# Altium schematic sheet LED_Sch.SchDoc
size A3; SheetNumber: 1; SheetTotal: 1
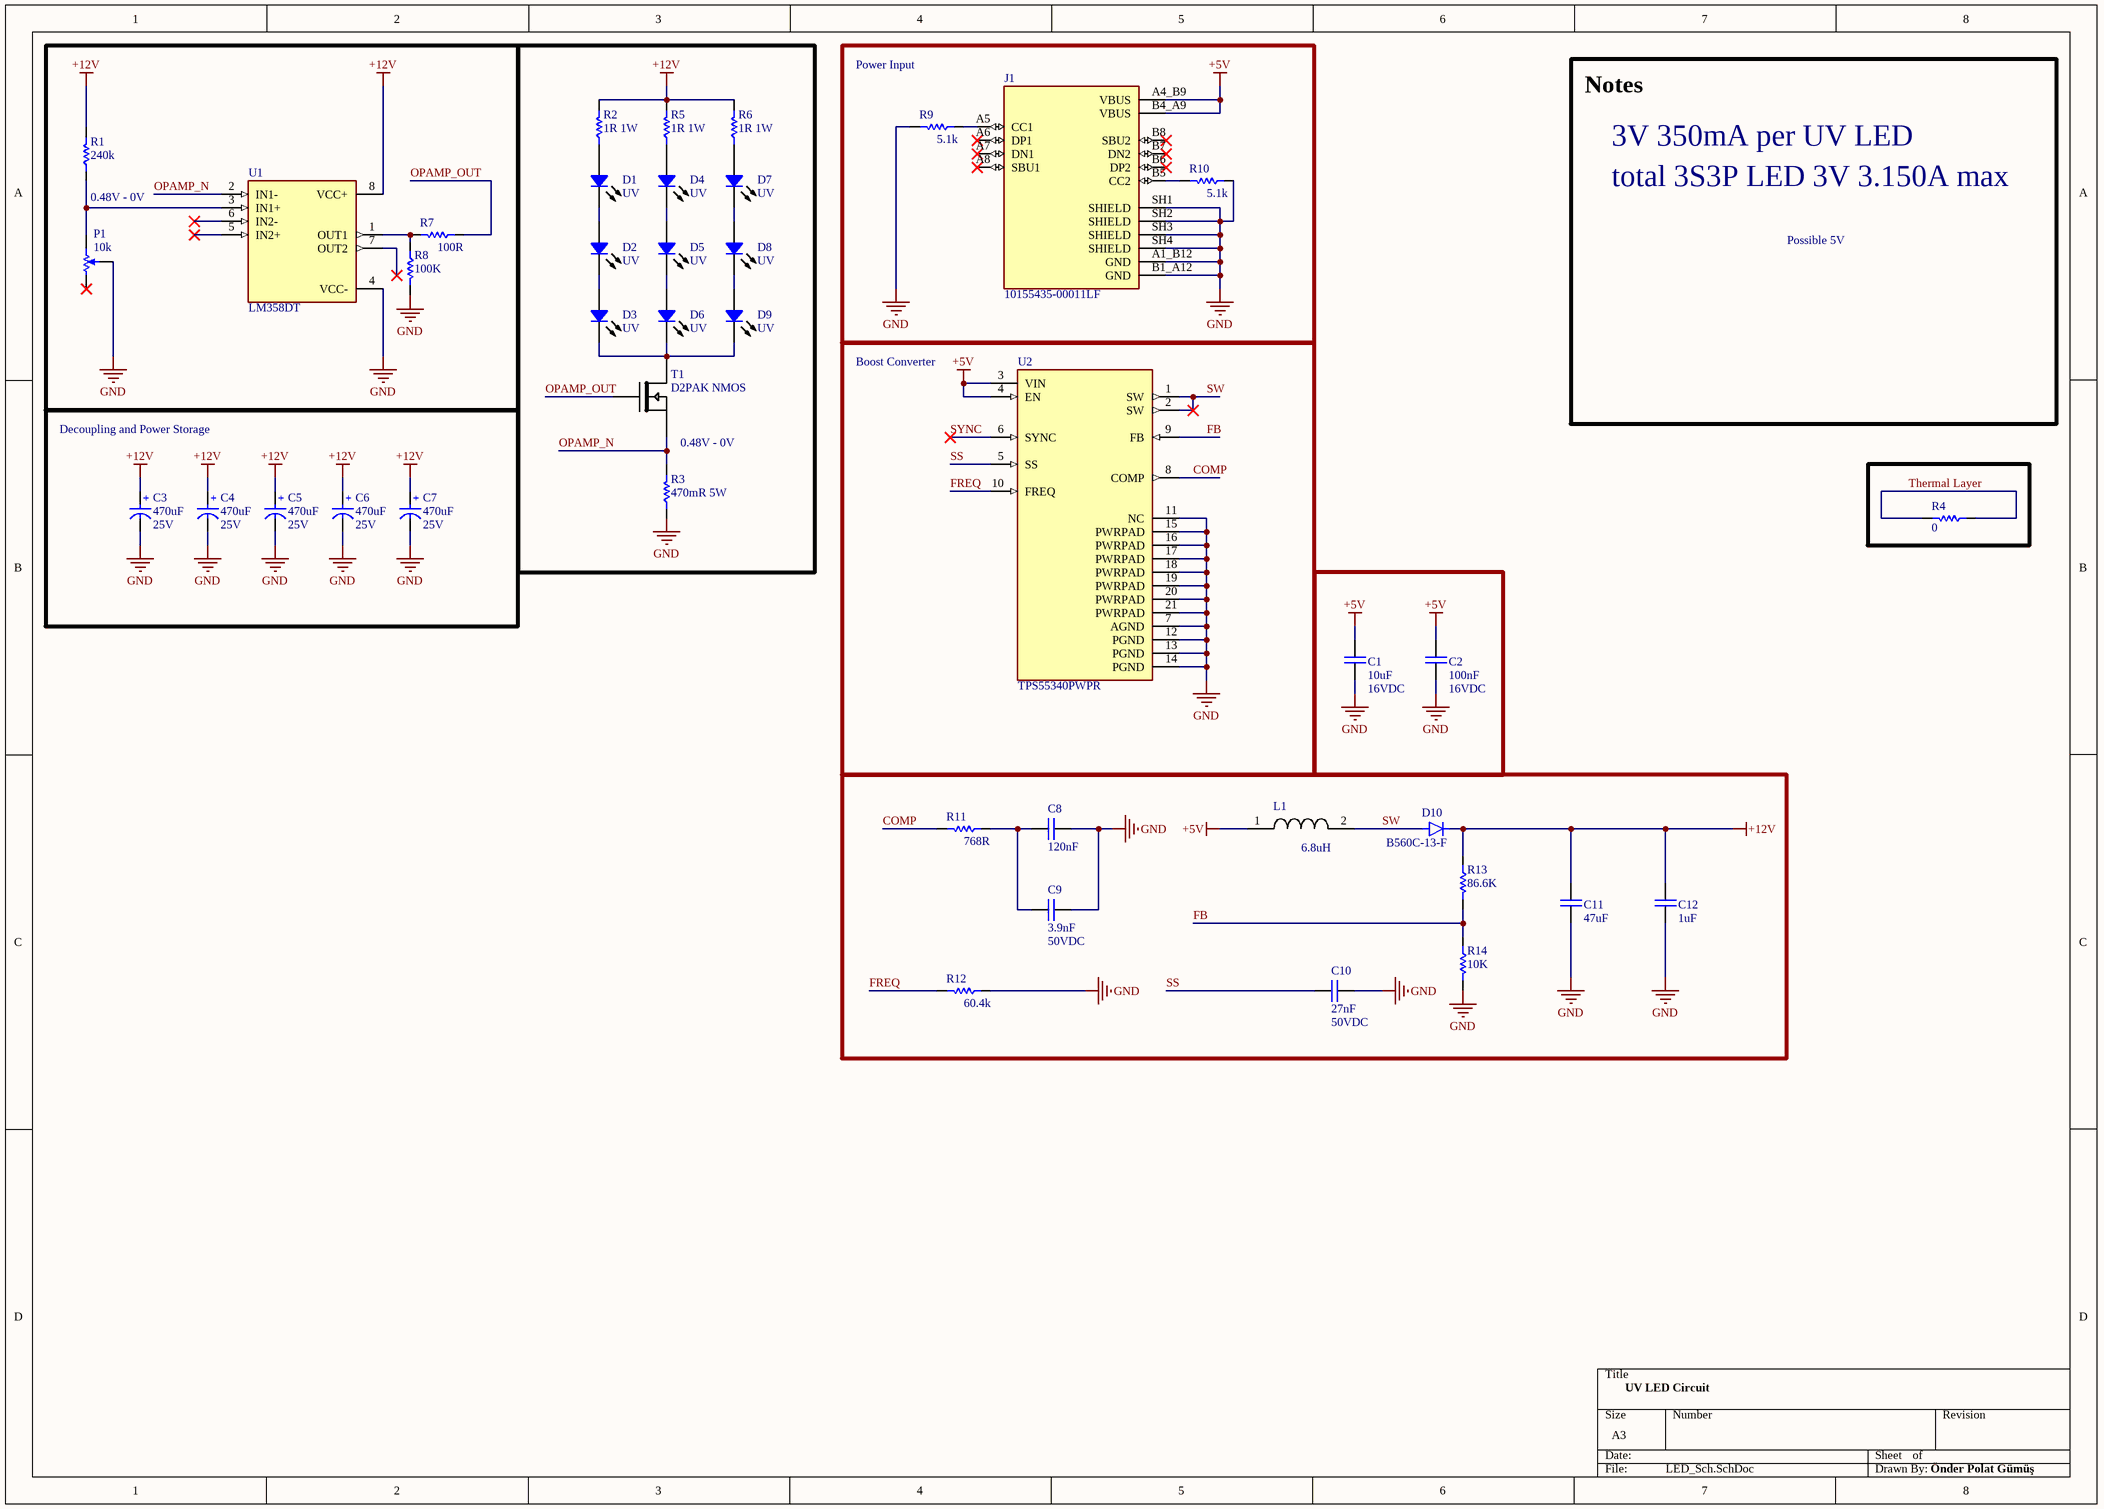
[diagram p0: LED_Sch.SchDoc]

## Parts
C1  Rating: 16VDC  [CAP 1206/3216]  (hidden comment: 10uF)
C2  Rating: 16VDC  [CAP 1206/3216]  (hidden comment: 100nF)
C3  Rating: 25V  [cap 03]  (hidden comment: 470uF)
C4  Rating: 25V  [cap 03]  (hidden comment: 470uF)
C5  Rating: 25V  [cap 03]  (hidden comment: 470uF)
C6  Rating: 25V  [cap 03]  (hidden comment: 470uF)
C7  Rating: 25V  [cap 03]  (hidden comment: 470uF)
C8  120nF  [1812_C]
C9  Rating: 50VDC  [CAP 0603/1608]  (hidden comment: 3.9nF)
C10  Rating: 50VDC  [CAP 0805/2012]  (hidden comment: 27nF)
C11  47uF  [CAP 1206/3216]
C12  1uF  [CAP 1206/3216]
D1  Inflow: UV  [POWER LED 1WATT]  (hidden comment: 3'Watt)
D2  Inflow: UV  [POWER LED 1WATT]  (hidden comment: 3'Watt)
D3  Inflow: UV  [POWER LED 1WATT]  (hidden comment: 3'Watt)
D4  Inflow: UV  [POWER LED 1WATT]  (hidden comment: 3'Watt)
D5  Inflow: UV  [POWER LED 1WATT]  (hidden comment: 3'Watt)
D6  Inflow: UV  [POWER LED 1WATT]  (hidden comment: 3'Watt)
D7  Inflow: UV  [POWER LED 1WATT]  (hidden comment: 3'Watt)
D8  Inflow: UV  [POWER LED 1WATT]  (hidden comment: 3'Watt)
D9  Inflow: UV  [POWER LED 1WATT]  (hidden comment: 3'Watt)
D10  B560C-13-F  [SMC]
J1  10155435-00011LF  [AMPHENOL_10155435-00011LF]
L1  Value?: 6.8uH  [PCBComponent_1]  (hidden comment: Inductor)
P1  10k  [POT_WH148]
R1  240k  [RES 1206 (3216X08L)]
R2  Inflow: 1R 1W  [Axial 1W  7_0mm]  (hidden comment: 1R)
R3  Inflow: 470mR 5W  [Res 5W]  (hidden comment: 27b)
R4  0  [Res-(1/4)]
R5  Inflow: 1R 1W  [Axial 1W  7_0mm]  (hidden comment: 1R)
R6  Inflow: 1R 1W  [Axial 1W  7_0mm]  (hidden comment: 1R)
R7  100R  [RES 1206 (3216X08L)]
R8  100K  [RES 1206 (3216X08L)]
R9  5.1k  [RES 1206 (3216X08L)]
R10  5.1k  [RES 1206 (3216X08L)]
R11  768R  [RES 1206 (3216X08L)]
R12  60.4k  [RES 1206 (3216X08L)]
R13  86.6K  [RES 1206 (3216X08L)]
R14  10K  [RES 1206 (3216X08L)]
T1  D2PAK NMOS  [D2PAK NMOS]
U1  LM358DT  [SOIC127P600X175-8N]
U2  TPS55340PWPR  [IC_TPS55340PWPR]

## Blocks framed on the sheet
0.48V - 0V: P1 R1 R7 R8 U1
0.48V - 0V: D1-D9 R2 R3 R5 R6 T1
Power Input: J1 R9 R10
Boost Converter: U2
Decoupling and Power Storage: C3-C7

## Nets
+5V: C1.1 C2.1 J1.A4_B9(VBUS) J1.B4_A9(VBUS) L1.1 U2.3(VIN) U2.4(EN)
+12V: C3.1(+) C4.1(+) C5.1(+) C6.1(+) C7.1(+) C11.1 C12.1 D10.C R1.2 R2.2 R5.2 R6.2 R13.1 U1.8(VCC+)
GND: C1.2 C2.2 C3.2(-) C4.2(-) C5.2(-) C6.2(-) C7.2(-) C8.2 C9.2 C10.2 C11.2 C12.2 J1.A1_B12(GND) J1.B1_A12(GND) J1.SH1(SHIELD) J1.SH2(SHIELD) J1.SH3(SHIELD) J1.SH4(SHIELD) P1.2(WIPER) R3.1 R8.2 R9.2 R10.1 R12.1 R14.2 U1.4(VCC-) U2.7(AGND) U2.11(NC) U2.12(PGND) U2.13(PGND) U2.14(PGND) U2.15(PWRPAD) U2.16(PWRPAD) U2.17(PWRPAD) U2.18(PWRPAD) U2.19(PWRPAD) U2.20(PWRPAD) U2.21(PWRPAD)
COMP: R11.2 U2.8(COMP)
FB: R13.2 R14.1 U2.9(FB)
FREQ: R12.2 U2.10(FREQ)
OPAMP_N: R3.2 T1.2 U1.2(IN1-)
OPAMP_OUT: R7.1 T1.0
SS: C10.1 U2.5(SS)
SW: D10.A L1.2 U2.1(SW) U2.2(SW)
SYNC: U2.6(SYNC)
Thermal Layer: R4.1 R4.2
NetC8_1: C8.1 C9.1 R11.1
NetD1_1: D1.1 R2.1
NetD1_2: D1.2 D2.1
NetD2_2: D2.2 D3.1
NetD3_2: D3.2 D6.2 D9.2 T1.1
NetD4_1: D4.1 R5.1
NetD4_2: D4.2 D5.1
NetD5_2: D5.2 D6.1
NetD7_1: D7.1 R6.1
NetD7_2: D7.2 D8.1
NetD8_2: D8.2 D9.1
NetJ1_A5: J1.A5(CC1) R9.1
NetJ1_B5: J1.B5(CC2) R10.2
NetP1_1: P1.1(CCW) R1.1 U1.3(IN1+)
NetR7_2: R7.2 R8.1 U1.1(OUT1)

Not connected (* = marked no-connect by the designer): J1 A6(DP1)* A7(DN1)* A8(SBU1)* B6(DP2)* B7(DN2)* B8(SBU2)*; P1 3(CW)*; U1 5(IN2+)* 6(IN2-)* 7(OUT2)*

## Notes on the sheet
- Notes
- 3V 350mA per UV LED
- total 3S3P LED 3V 3.150A max
- Possible 5V
- UV LED Circuit
- Önder Polat Gümüş

## Library data of the parts
C1 C2 C8-C10 = Cap_Multi_SMD: Bipolar ceramic capacitor SMD; Inflow: inflow?; Type: Type?; Validation: Valid; Package: Package?
  C1: Value: 10uF
  C2: Value: 100nF
  C8: Value: 120nF
  C9: Value: 3.9nF
  C10: Value: 27nF
C3-C7 = Cap_Electrolit: Electrolit Capacitor; Inflow: inflow?; Validation: Valid; Package: Dip; Type: Electrolit; Value: 470uF
C11 C12 = Cap_Multi_SMD: Bipolar ceramic capacitor SMD; Inflow: inflow?; Type: Type?; Validation: Valid; Rating: 16VDC; Package: Package?
  C11: Value: 47uF
  C12: Value: 1uF
D1-D9 = Semi_LED_Power: POWER LED SMD; Rating: Rating?; Type: Type?; Validation: NT; Value: 3'Watt; Package: Package?
D10 = B560C-13-F: Diode Schottky 60 V 5A Surface Mount SMC; MF: Diodes Inc.; SnapEDA_Link: https://www.snapeda.com/parts/B560C-13-F/Diodes+Inc./view-part/?ref=snap; Package: SMC-2 Diodes; Value: *; MP: B560C-13-F; Check_prices: https://www.snapeda.com/parts/B560C-13-F/Diodes+Inc./view-part/?ref=eda
P1 = Res_Pot: Potentiometer; Rating: POT 1/8W; Package: POT 1/8W; Type: POT 1/8W; Value: 10k; Validation: POT 1/8W; Inflow: POT 1/8W
R1 = Res_SMD: Resistor; Inflow: inflow?; Rating: 1/4W; Validation: Valid; Package: 1206; Type: %5; Value: 240k
R2 R5 R6 = Res_1b_THT_1: Resistor; Rating: Rating?; Validation: NT; Package: Package?; Type: 1W; Value: 1R
R3 = Res_27b_THT_5: Resistor; Rating: Rating?; Validation: NT; Package: Dip 5W; Type: 5W; Value: 27b
R4 = Res_THT: Resistor; Inflow: inflow?; Rating: 0.25W; Validation: Valid; Package: Dip; Type: 10%; Value: 0
R7-R14 = Res_SMD: Resistor; Inflow: inflow?; Rating: Rating?; Validation: Valid; Package: 1206; Type: 10%
  R7: Value: 100R
  R8: Value: 100K
  R9 R10: Value: 5.1k
  R11: Value: 768R
  R12: Value: 60.4k
  R13: Value: 86.6K
  R14: Value: 10K
T1 = D2PAK NMOS: for SQM70060EL or any D2PAK NMOS
U1 = LM358DT: General Purpose Amplifier 2 Circuit 8-SO; MF: STMicroelectronics; Price: None; Package: SOIC-8 STMicroelectronics; MP: LM358DT; Value: *; Availability: Unavailable; SnapEDA_Link: https://www.snapeda.com/parts/LM358DT/STMicroelectronics/view-part/6634/?ref=snap
U2 = TPS55340PWPR: 5-A, 40-V, wide VIN boost, flyback, & SEPIC converter; MF: Texas Instruments; Purchase-URL: https://pricing.snapeda.com/search/part/TPS55340PWPR/?ref=eda; Package: HTSSOP-14 Texas Instruments; Check_prices: https://www.snapeda.com/parts/TPS55340PWPR/Texas+Instruments/view-part/?ref=eda; Value: *; SnapEDA_Link: https://www.snapeda.com/parts/TPS55340PWPR/Texas+Instruments/view-part/?ref=snap; MP: TPS55340PWPR; Digi-Key_Part_Number: 296-39426-2-ND
J1 = 10155435-00011LF: Package: None; Price: None; Value: *; MP: 10155435-00011LF; Availability: Unavailable